# EAGLE design shaki_rev_a (EAGLE 6.5.0)
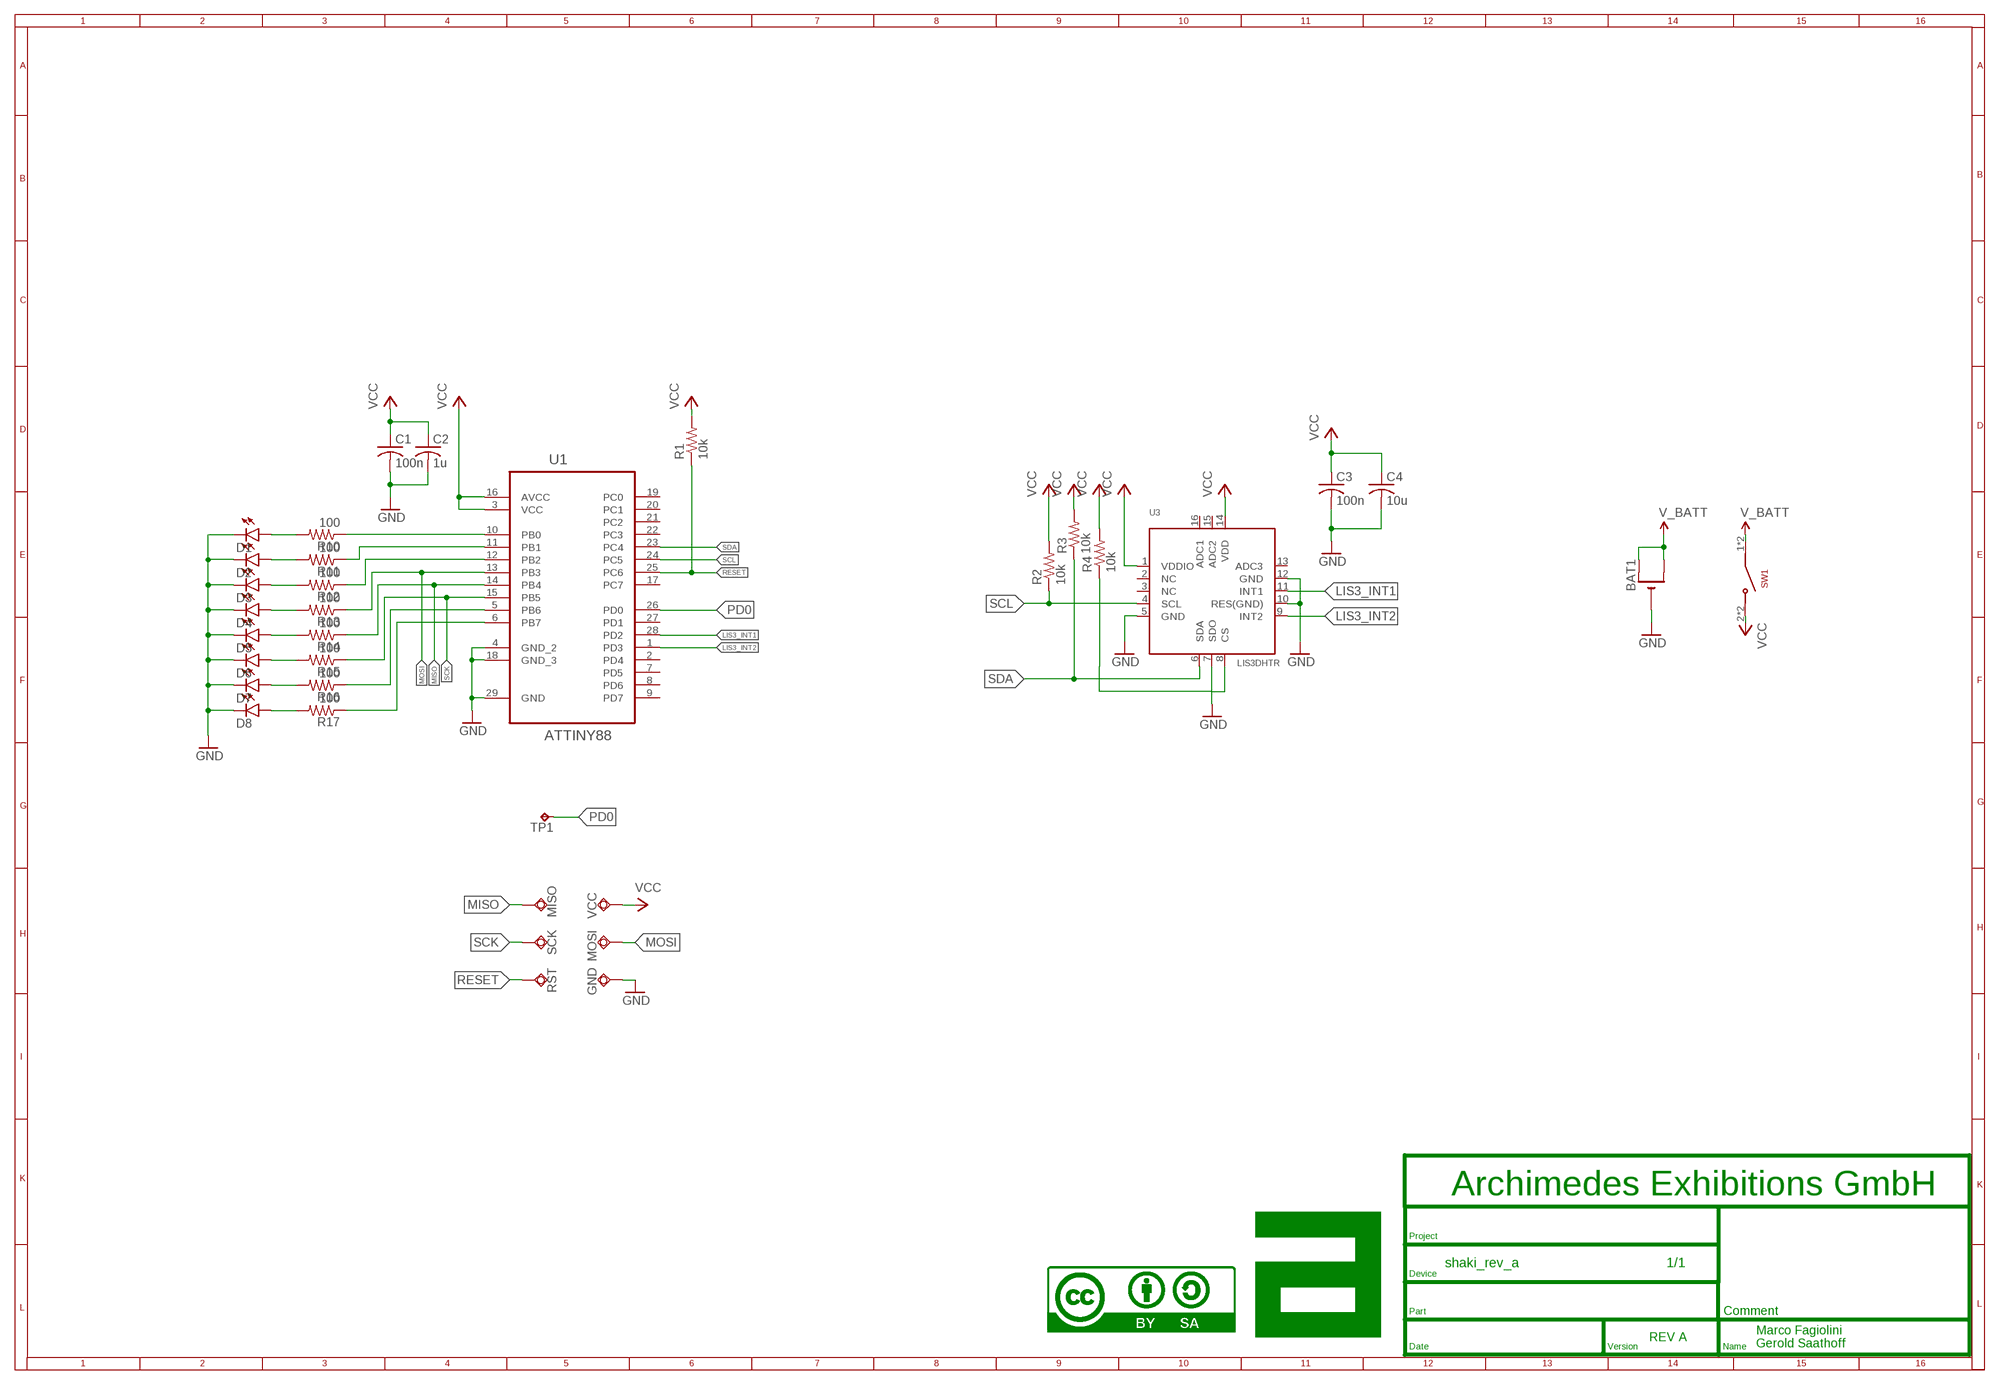
[diagram p0: schematic, sheet 1]

## Parts
BAT1  CR1220SMT  [CR1220-SMD]
C1  100n  C-USC0603K  [C0603K]
C2  1u  C-USC0603K  [C0603K]
C3  100n  C-USC0603K  [C0603K]
C4  10u  C-USC0603K  [C0603K]
D1  LED0603  [LED-0603]
D2  LED0603  [LED-0603]
D3  LED0603  [LED-0603]
D4  LED0603  [LED-0603]
D5  LED0603  [LED-0603]
D6  LED0603  [LED-0603]
D7  LED0603  [LED-0603]
D8  LED0603  [LED-0603]
GND  TPSQTP13R  [TP13R]
MISO  TPSQTP13R  [TP13R]
MOSI  TPSQTP13R  [TP13R]
R1  10k  0.05OHM-1/5W-1%(0603)  [0603]
R2  10k  0.05OHM-1/5W-1%(0603)  [0603]
R3  10k  0.05OHM-1/5W-1%(0603)  [0603]
R4  10k  0.05OHM-1/5W-1%(0603)  [0603]
R10  100  0.05OHM-1/5W-1%(0603)  [0603]
R11  100  0.05OHM-1/5W-1%(0603)  [0603]
R12  100  0.05OHM-1/5W-1%(0603)  [0603]
R13  100  0.05OHM-1/5W-1%(0603)  [0603]
R14  100  0.05OHM-1/5W-1%(0603)  [0603]
R15  100  0.05OHM-1/5W-1%(0603)  [0603]
R16  100  0.05OHM-1/5W-1%(0603)  [0603]
R17  100  0.05OHM-1/5W-1%(0603)  [0603]
RST  TPSQTP13R  [TP13R]
SCK  TPSQTP13R  [TP13R]
SW1  SKRRABE010  [SKRRABE010]
TP1  TESTPAD  [TESTPAD]
U1  ATTINY88  ATTINY48-MMU  [QFN45P400X400X100-29N]
U3  LIS3DHTR  ACCEL_LIS3DHTR  [LGA16_3X3MM]
VCC  TPSQTP13R  [TP13R]

## Nets
GND: BAT1.- C1.2 C2.2 C3.2 C4.2 D1.C D2.C D3.C D4.C D5.C D6.C D7.C D8.C GND.TP U1.4(GND_2) U1.18(GND_3) U1.29(GND) U3.5(GND) U3.7(SDO) U3.10(RES(GND)) U3.12(GND)
LED1: R10.1 U1.10(PB0)
LED2: R11.1 U1.11(PB1)
LED3: R12.1 U1.12(PB2)
LED7: R16.1 U1.5(PB6)
LED8: R17.1 U1.6(PB7)
LIS3_INT1: U1.28(PD2) U3.11(INT1)
LIS3_INT2: U1.1(PD3) U3.9(INT2)
MISO: MISO.TP R14.1 U1.14(PB4)
MOSI: MOSI.TP R13.1 U1.13(PB3)
N$2: R4.1 U3.8(CS)
N$9: D1.A R10.2
N$10: D2.A R11.2
N$11: D3.A R12.2
N$12: D4.A R13.2
N$13: D5.A R14.2
N$14: D6.A R15.2
N$15: D7.A R16.2
N$16: D8.A R17.2
PD0: TP1.P$1(TP) U1.26(PD0)
RESET: R1.1 RST.TP U1.25(PC6)
SCK: R15.1 SCK.TP U1.15(PB5)
SCL: R2.1 U1.24(PC5) U3.4(SCL)
SDA: R3.1 U1.23(PC4) U3.6(SDA)
V_BATT: BAT1.+$1(+) BAT1.+$2(+1) SW1.1 SW1.3
VCC: C1.1 C2.1 C3.1 C4.1 R1.2 R2.2 R3.2 R4.2 SW1.2 SW1.4 U1.3(VCC) U1.16(AVCC) U3.1(VDDIO) U3.14(VDD) VCC.TP
Unconnected: U1.2(PD4) U1.7(PD5) U1.8(PD6) U1.9(PD7) U1.17(PC7) U1.19(PC0) U1.20(PC1) U1.21(PC2) U1.22(PC3) U1.27(PD1) U3.2(NC) U3.3(NC) U3.13(ADC3) U3.15(ADC2) U3.16(ADC1)

## Notes on the sheet
- REV A
- Marco Fagiolini
  Gerold Saathoff

## Library data of the parts
BAT1 = adafruit Kopie:CR1220: CR1216/CR1220/CR1225 12mm 3V lithium coin cell Great for battery packup. Both SMT and THM holders. Note the THM package has the ground pads on both sides of the PCB so that the masks are the same - this reduces the cost
C1-C4 = rcl:C-US: CAPACITOR, American symbol
D1-D8 = SparkFun-LED:LED: LEDs Standard schematic elements and footprints for 5mm, 3mm, 1206, and 0603 sized LEDs. 5mm - Spark Fun Electronics SKU : COM-00529 (and others)
GND MISO MOSI RST SCK VCC = testpad:TPSQ: Test pad
R1-R4 R10-R17 = SparkFun-Resistors:0.05OHM-1/5W-1%(0603); PROD_ID: RES-12535
SW1 = pimoroni-mechanical:SKRRABE010
TP1 = _AMD_specialparts 3:TESTPAD
U1 = atmel2:ATTINY48-MMU: MCU, 8BIT, AVR, 4K FLASH, QFN-28; MPN: ATTINY48-MMU; OC_FARNELL: 1972166; OC_NEWARK: 68T3772; PACKAGE: QFN-28; SUPPLIER: ATMEL
U3 = microbuilder:ACCEL_LIS3DHTR: LIS3DHTR 3-Axis Accelerometer with I2C/SPI Interface VDD: 1.71-3.6V VDDIO: 1.71-VDD+0.1V Scale: +/-2g, 4g, 8g, 16g with 16--bit data output Temp:: -40°C - 85°C Mouser: 511-LIS3DHTR Digikey: 497-10613-1-ND

## Board
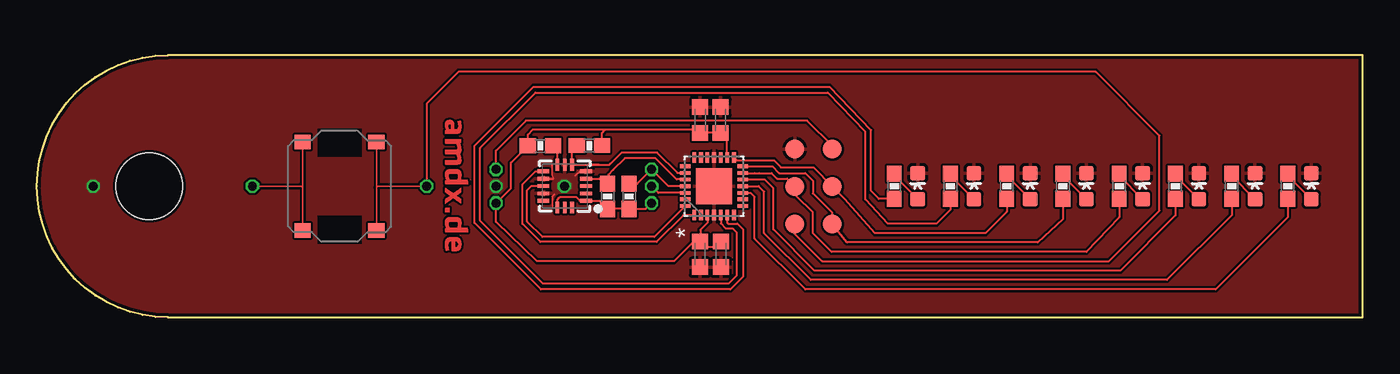
[diagram p1: board, top side]
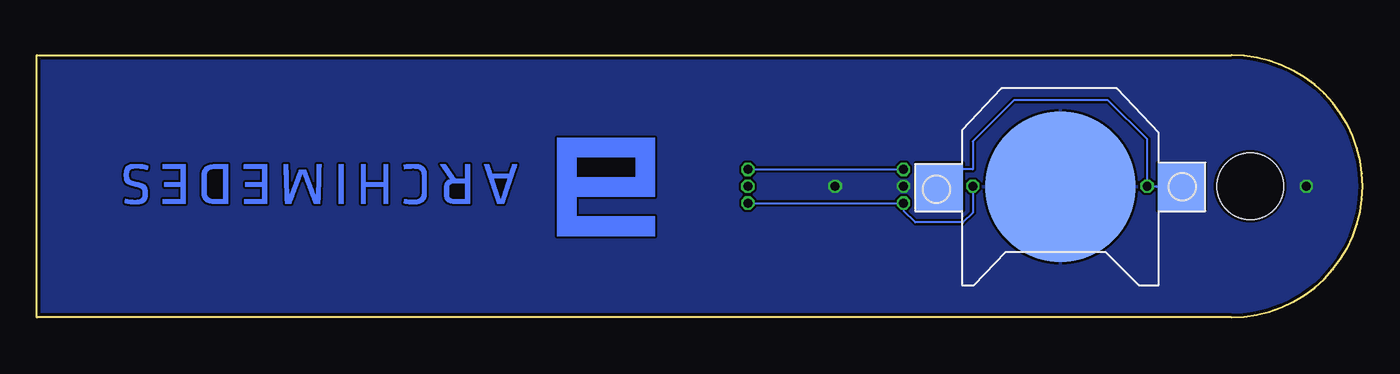
[diagram p2: board, bottom side, seen from below]

Size 89.84 x 17.78 mm. Coordinates in mm from the lower left corner, seen from the top.
Outline: 8.89,17.77 89.84,17.77 89.84,0 8.89,0 arc-180 8.89,17.78
Copper layers (1*16): Top 0.035mm / dielectric 1.5mm / Bottom 0.035mm
Design rules "Eagle-DRU - 1506 - LeitOn - 01 and 02 layers - STANDARD *": minimum track width 0.15mm, minimum drill 0.3mm, track to track 0.15mm, track to pad 0.15mm, pad to pad 0.15mm, via to via 0.15mm, smd to smd 0.15mm, copper to edge 0.2mm, drill to drill 0.25mm, minimum pad ring 0.15mm, minimum via ring 0.15mm, stop-mask expansion 0.05mm, vias tented up to drill 0mil, thermal gap 0.2mm
Holes 4.5 mm at 7.62,8.89

### Footprints (pad centres in the part's own frame; a part is rotated, then mirrored left to right if it is on the bottom)
CR1220-SMD = smd 3.2 x 3.2: +$1 -8.2,0; +$2 8.2,0 | smd 10.16 x 10.16: - 0,0
C0603K = smd 1.05 x 1.08: 1 -0.875,0; 2 0.875,0
LED-0603 = smd 1 x 1: A 0,-0.877; C 0,0.877
TP13R = smd 1.3 x 1.3: TP 0,0
0603 = smd 1.1 x 1: 1 -0.85,0; 2 0.85,0
SKRRABE010 = smd 1 x 1.1: 1 -3,2.5; 2 -3,-2.5; 3 3,2.5; 4 3,-2.5
TESTPAD = drill 0.6 octagon: P$1 0,0
QFN45P400X400X100-29N = smd 0.711 x 0.254: 1 -1.956,1.346; 2 -1.956,0.889; 3 -1.956,0.457; 4 -1.956,0; 5 -1.956,-0.457; 6 -1.956,-0.889; 7 -1.956,-1.346; 15 1.956,-1.346; 16 1.956,-0.889; 17 1.956,-0.457; 18 1.956,0; 19 1.956,0.457; 20 1.956,0.889; 21 1.956,1.346 | smd 0.254 x 0.711: 8 -1.346,-1.956; 9 -0.889,-1.956; 10 -0.457,-1.956; 11 0,-1.956; 12 0.457,-1.956; 13 0.889,-1.956; 14 1.346,-1.956; 22 1.346,1.956; 23 0.889,1.956; 24 0.457,1.956; 25 0,1.956; 26 -0.457,1.956; 27 -0.889,1.956; 28 -1.346,1.956 | smd 2.438 x 2.438: 29 0,0
LGA16_3X3MM = smd 0.8 x 0.25: 1 -1.45,1; 2 -1.45,0.5; 3 -1.45,0; 4 -1.45,-0.5; 5 -1.45,-1; 9 1.45,-1; 10 1.45,-0.5; 11 1.45,0; 12 1.45,0.5; 13 1.45,1 | smd 0.25 x 0.8: 6 -0.5,-1.45; 7 0,-1.45; 8 0.5,-1.45; 14 0.5,1.45; 15 0,1.45; 16 -0.5,1.45

### Placement (x,y rotation side)
BAT1  20.49,8.85 180 bottom
C1  46.33,13.38 90 top
C2  44.95,13.38 90 top
C3  44.93,4.29 270 top
C4  46.36,4.29 270 top
D1  86.36,8.89 0 top
D2  82.55,8.89 0 top
D3  78.74,8.89 0 top
D4  74.93,8.89 0 top
D5  71.12,8.89 0 top
D6  67.31,8.89 0 top
D7  63.5,8.89 0 top
D8  59.69,8.89 0 top
GND  51.37,11.4 270 top
MISO  53.91,6.32 270 top
MOSI  51.37,8.86 270 top
R1  40.12,8.2 270 top
R2  38.67,8.2 270 top
R3  37.44,11.65 0 top
R4  34.12,11.63 180 top
R10  84.77,8.89 90 top
R11  80.96,8.89 90 top
R12  77.15,8.89 90 top
R13  73.34,8.89 90 top
R14  69.53,8.89 90 top
R15  65.72,8.89 90 top
R16  61.91,8.89 90 top
R17  58.1,8.89 90 top
RST  53.91,11.4 270 top
SCK  53.91,8.86 270 top
SW1  20.51,8.89 90 top
TP1  41.66,8.89 0 top
U1  45.89,8.89 90 top
U3  35.77,8.9 180 top
VCC  51.37,6.32 270 top

### Tracks (layer width: path | path; a pad name or v marks a point on that pad's centre or on a via)
GND  (via drill 0.6)
  Top 0.1: U3.5 36.82,9.9 36.45,9.61 | 34.93,7.5 34.93,8.05 34.93,8.2 | 34.93,10.32 34.93,9.76 34.93,9.65 35,9.4
  Top 0.15: U3.10 35,9.4 | 34.93,8.2 35.05,8.32
  other vias: 35.75,8.89 3.81,8.89 31.12,8.89
  pour Bottom: -0.41,17.78 -0.41,0 90.17,0 90.17,17.78
  pour Top: -0.36,17.78 -0.36,0 90.17,0 90.17,17.78
LED1
  Top 0.15: R10.1 84.77,6.79 79.88,1.9 52.07,1.9 48.64,5.33 48.64,8.17 48.37,8.44
  Top 0.152: U1.10 48.37,8.44
LED2
  Top 0.15: R11.1 80.96,6.92 76.58,2.54 52.45,2.54 49.28,5.71 49.28,8.52 48.9,8.89
  Top 0.152: U1.11 48.9,8.89
LED3
  Top 0.15: R12.1 77.15,6.92 73.41,3.17 52.7,3.17 49.91,5.97 49.91,8.74 49.3,9.35
  Top 0.152: U1.12 49.3,9.35
LED7
  Top 0.15: R16.1 61.91,7.3 60.96,6.35 57.66,6.35 56.13,8 56.13,12.57 53.59,15.24 33.78,15.24 30.04,11.49 30.04,6.54 34.29,2.29 46.86,2.29 47.39,2.82 47.39,5.78
  Top 0.152: U1.5 46.34,6.37 46.68,6.03 47.16,6.03 47.16,6.02 47.39,5.78
LED8
  Top 0.15: R17.1 57.06,8.04 56.52,8.57 | 46.99,1.9 34.16,1.9 29.65,6.41 29.65,11.62 33.65,15.62 53.72,15.62
  Top 0.152: U1.6 46.77,6.42 46.84,6.35 47.47,6.35 47.88,5.95 47.88,2.79 46.99,1.9 | 56.52,8.57 56.52,12.69 53.72,15.62
LIS3_INT1
  Top 0.15: U1.28 41.84,5.46 34.27,5.46 33.23,6.49 33.23,8.62 33.52,8.91 U3.11
LIS3_INT2
  Top 0.15: U1.1 43.82,6.94 42,5.12 34.13,5.12 32.9,6.34 32.9,9.01 33.79,9.9 U3.9
MISO
  Top 0.15: 48.98,10.24 49.83,10.24 50.29,9.78 52.07,9.78 52.58,9.27 52.58,8.41 53.91,7.08 MISO.TP | MISO.TP 53.91,5.91 | R14.1 69.53,7.05 69.53,6.67 67.82,5.08 54.9,5.08 MISO.TP | 54.13,6.1 MISO.TP
  Top 0.152: U1.14 48.51,10.24 48.98,10.24 | MISO.TP 53.66,6.32
MOSI
  Top 0.15: 48.97,9.78 49.78,9.78 50.16,9.4 50.83,9.4 MOSI.TP 51.37,8.32 51.43,8.25 52.58,7.11 52.58,5.71 53.85,4.44 71.12,4.44 73.34,6.79 R13.1
  Top 0.152: U1.13 48.65,9.78 48.97,9.78
N$2
  Top 0.15: U3.8 35.27,11.65 R4.1
N$9
  Top 0.152: R10.2 84.77,9.6 D1.A
N$10
  Top 0.152: R11.2 80.96,9.6 D2.A
N$11
  Top 0.152: R12.2 77.15,9.6 D3.A
N$12
  Top 0.152: R13.2 73.34,9.6 D4.A
N$13
  Top 0.152: R14.2 69.53,9.6 D5.A
N$14
  Top 0.152: R15.2 65.72,9.6 D6.A
N$15
  Top 0.152: R16.2 61.91,9.6 D7.A
N$16
  Top 0.152: R17.2 58.1,9.6 D8.A
PD0
  Top 0.15: U1.26 42.11,8.44 TP1.P$1
RESET  (via drill 0.6)
  Top 0.15: RST.TP 53.91,11.62 52.2,13.33 33.15,13.33 31.11,11.3 v31.11,10.03 | 40.67,9.05 R1.1 40.67,9.05 | 40.67,9.05 41.53,9.91 v41.66,10.03 42.8,8.89 U1.25
  Top 0.152: RST.TP 53.97,11.4
  Bottom 0.15: v41.66,10.03 v31.11,10.03
SCK
  Top 0.15: 47.44,10.64 49.94,10.64 50.42,10.16 52.61,10.16 SCK.TP 54.74,8.03 56.8,5.71 64.26,5.71 65.72,7.18 R15.1
  Top 0.152: 47.44,10.64 U1.15 | SCK.TP 53.66,8.86
SCL
  Top 0.15: U1.24 43.36,9.35 41.91,10.79 39.85,10.79 39.05,10 38.73,9.68 38.73,9.12 R2.1 38.89,9.4 38.1,9.4 U3.4
SDA
  Top 0.15: R3.1 36.27,11.65 U3.6 36.79,10.35 | 36.79,10.35 38.07,10.35 | 38.07,10.35 36.79,10.35 | 36.79,10.35 38.07,10.35 | U1.23 43.4,9.78 43.4,9.81 42.04,11.18 39.62,11.18 38.86,10.41 38.8,10.35 38.07,10.35
V_BATT  (via drill 0.6)
  Top 0.1: v14.6,8.89 17.83,8.89 17.93,8.89 18.01,8.81 | SW1.3 18.01,8.81 | 18.01,8.81 SW1.1
  Bottom 0.15: BAT1.+$1 12.19,8.85 12.58,8.85 13.97,8.85 | 13.97,8.85 14.57,8.85 v14.6,8.89 | v14.6,8.89 14.6,12.06 17.27,14.73 23.62,14.73 26.42,11.94 26.42,10.03 27.69,10.03 27.81,9.91 27.81,9.12 28.04,8.89 | v14.6,8.89 14.01,8.89 13.97,8.85 | 27.56,8.89 28.04,8.89 | 28.04,8.89 28.65,8.89 BAT1.+$2
VCC  (via drill 0.6)
  Top 0.1: v26.42,8.89 23.16,8.89 23.09,8.89 23.01,8.81 | SW1.4 23.01,8.81 | 23.01,8.81 SW1.2
  Top 0.15: R4.2 33.27,12.39 33.59,12.71 38.51,12.71 | 33.02,11.89 R4.2 | 51.37,6.22 51.37,5.65 53.21,3.81 72.64,3.81 76.07,7.24 76.07,12.32 71.75,16.64 28.57,16.64 26.42,14.48 v26.42,8.89 | 44.96,5.94 44.96,5.59 44.45,5.08 43.18,3.81 33.91,3.81 31.11,6.48 v31.11,7.75 32.13,8.76 32.13,10.49 R4.2 | v41.66,7.75 41.26,7.35 R1.2 38.92,7.35 R2.2 38.12,7.9 U3.1 36.8,7.9 36.58,8.13 35.43,8.13 35.27,7.96 U3.14 | 44.93,12.71 38.51,12.71 | R3.2 38.29,12.49 38.51,12.71 | C1.1 C2.1
  Top 0.152: U1.16 46.77,12.38 C1.1 46.69,12.54 | VCC.TP 51.37,6.22 | C2.1 44.95,12.53 44.93,12.71 | C4.1 46.68,4.92 46.52,4.76 44.69,4.76 C3.1 44.96,5.19 44.96,5.94 45.43,6.41 U1.3
  Bottom 0.15: v41.66,7.75 v31.11,7.75 31.11,7.25 30.31,6.45 27.07,6.45 26.42,7.1 v26.42,8.89
(copper drawn outside any net)
  shapes: Bottom area x3253, Top area x740